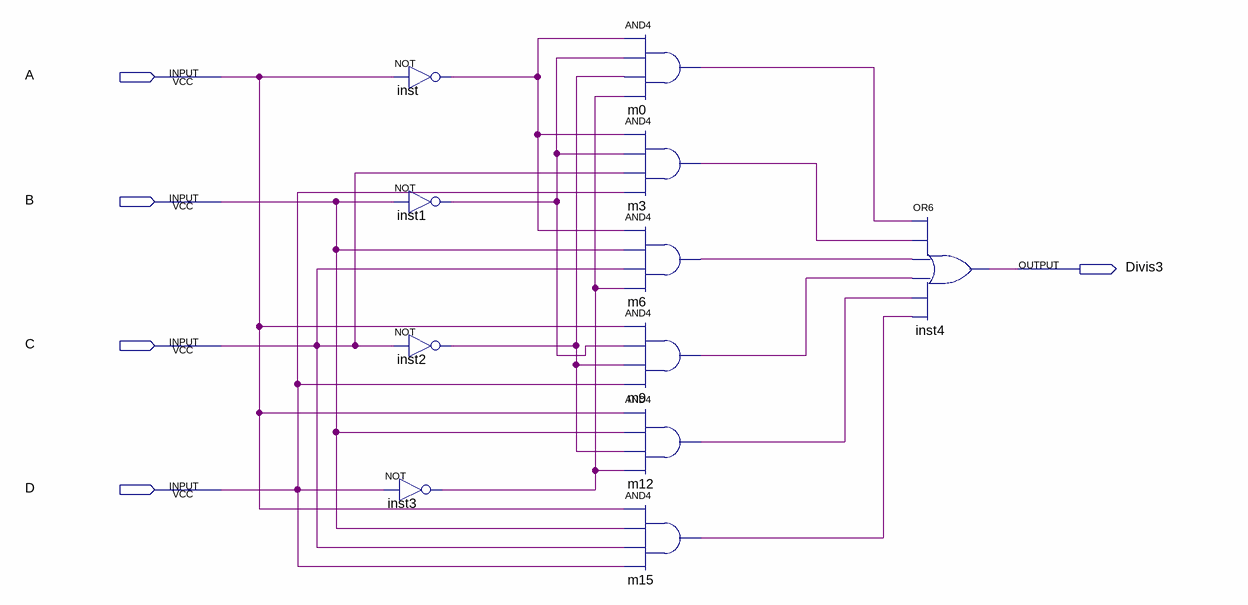
[diagram p0: schematic sheet]
// Quartus schematic D_SOP.bdf as structural Verilog: 11 symbols, 5 pins
module D_SOP (
  input  A,
  input  B,
  input  C,
  input  D,
  output Divis3
);

  wire inst1_out, inst2_out, inst3_out, inst_out, m0_out, m3_out, m6_out, m9_out, m12_out, m15_out;

  not inst (inst_out, A);
  not inst1 (inst1_out, B);
  not inst2 (inst2_out, C);
  not inst3 (inst3_out, D);
  and m0 (m0_out, inst_out, inst1_out, inst2_out, inst3_out);
  and m3 (m3_out, inst_out, inst1_out, C, D);
  and m6 (m6_out, inst_out, B, C, inst3_out);
  and m9 (m9_out, A, inst1_out, inst2_out, D);
  and m12 (m12_out, A, B, inst2_out, inst3_out);
  and m15 (m15_out, A, B, C, D);
  or inst4 (Divis3, m0_out, m3_out, m6_out, m9_out, m12_out, m15_out);
endmodule
